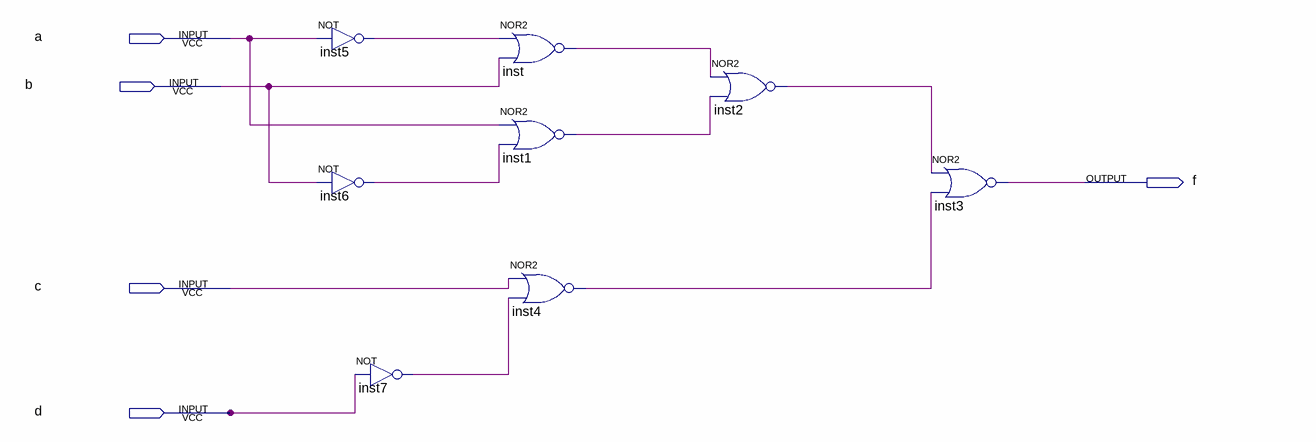
[diagram p0: schematic sheet]
// Quartus schematic work_01.bdf as structural Verilog: 8 symbols, 5 pins
module work_01 (
  input  a,
  input  b,
  input  c,
  input  d,
  output f
);

  wire inst1_out, inst2_out, inst4_out, inst5_out, inst6_out, inst7_out, inst_out;

  not inst5 (inst5_out, a);
  not inst6 (inst6_out, b);
  not inst7 (inst7_out, d);
  nor inst (inst_out, inst5_out, b);
  nor inst1 (inst1_out, a, inst6_out);
  nor inst4 (inst4_out, c, inst7_out);
  nor inst2 (inst2_out, inst_out, inst1_out);
  nor inst3 (f, inst2_out, inst4_out);
endmodule
